# EasyEDA Pro project design-2.eprj, board PCB4_2
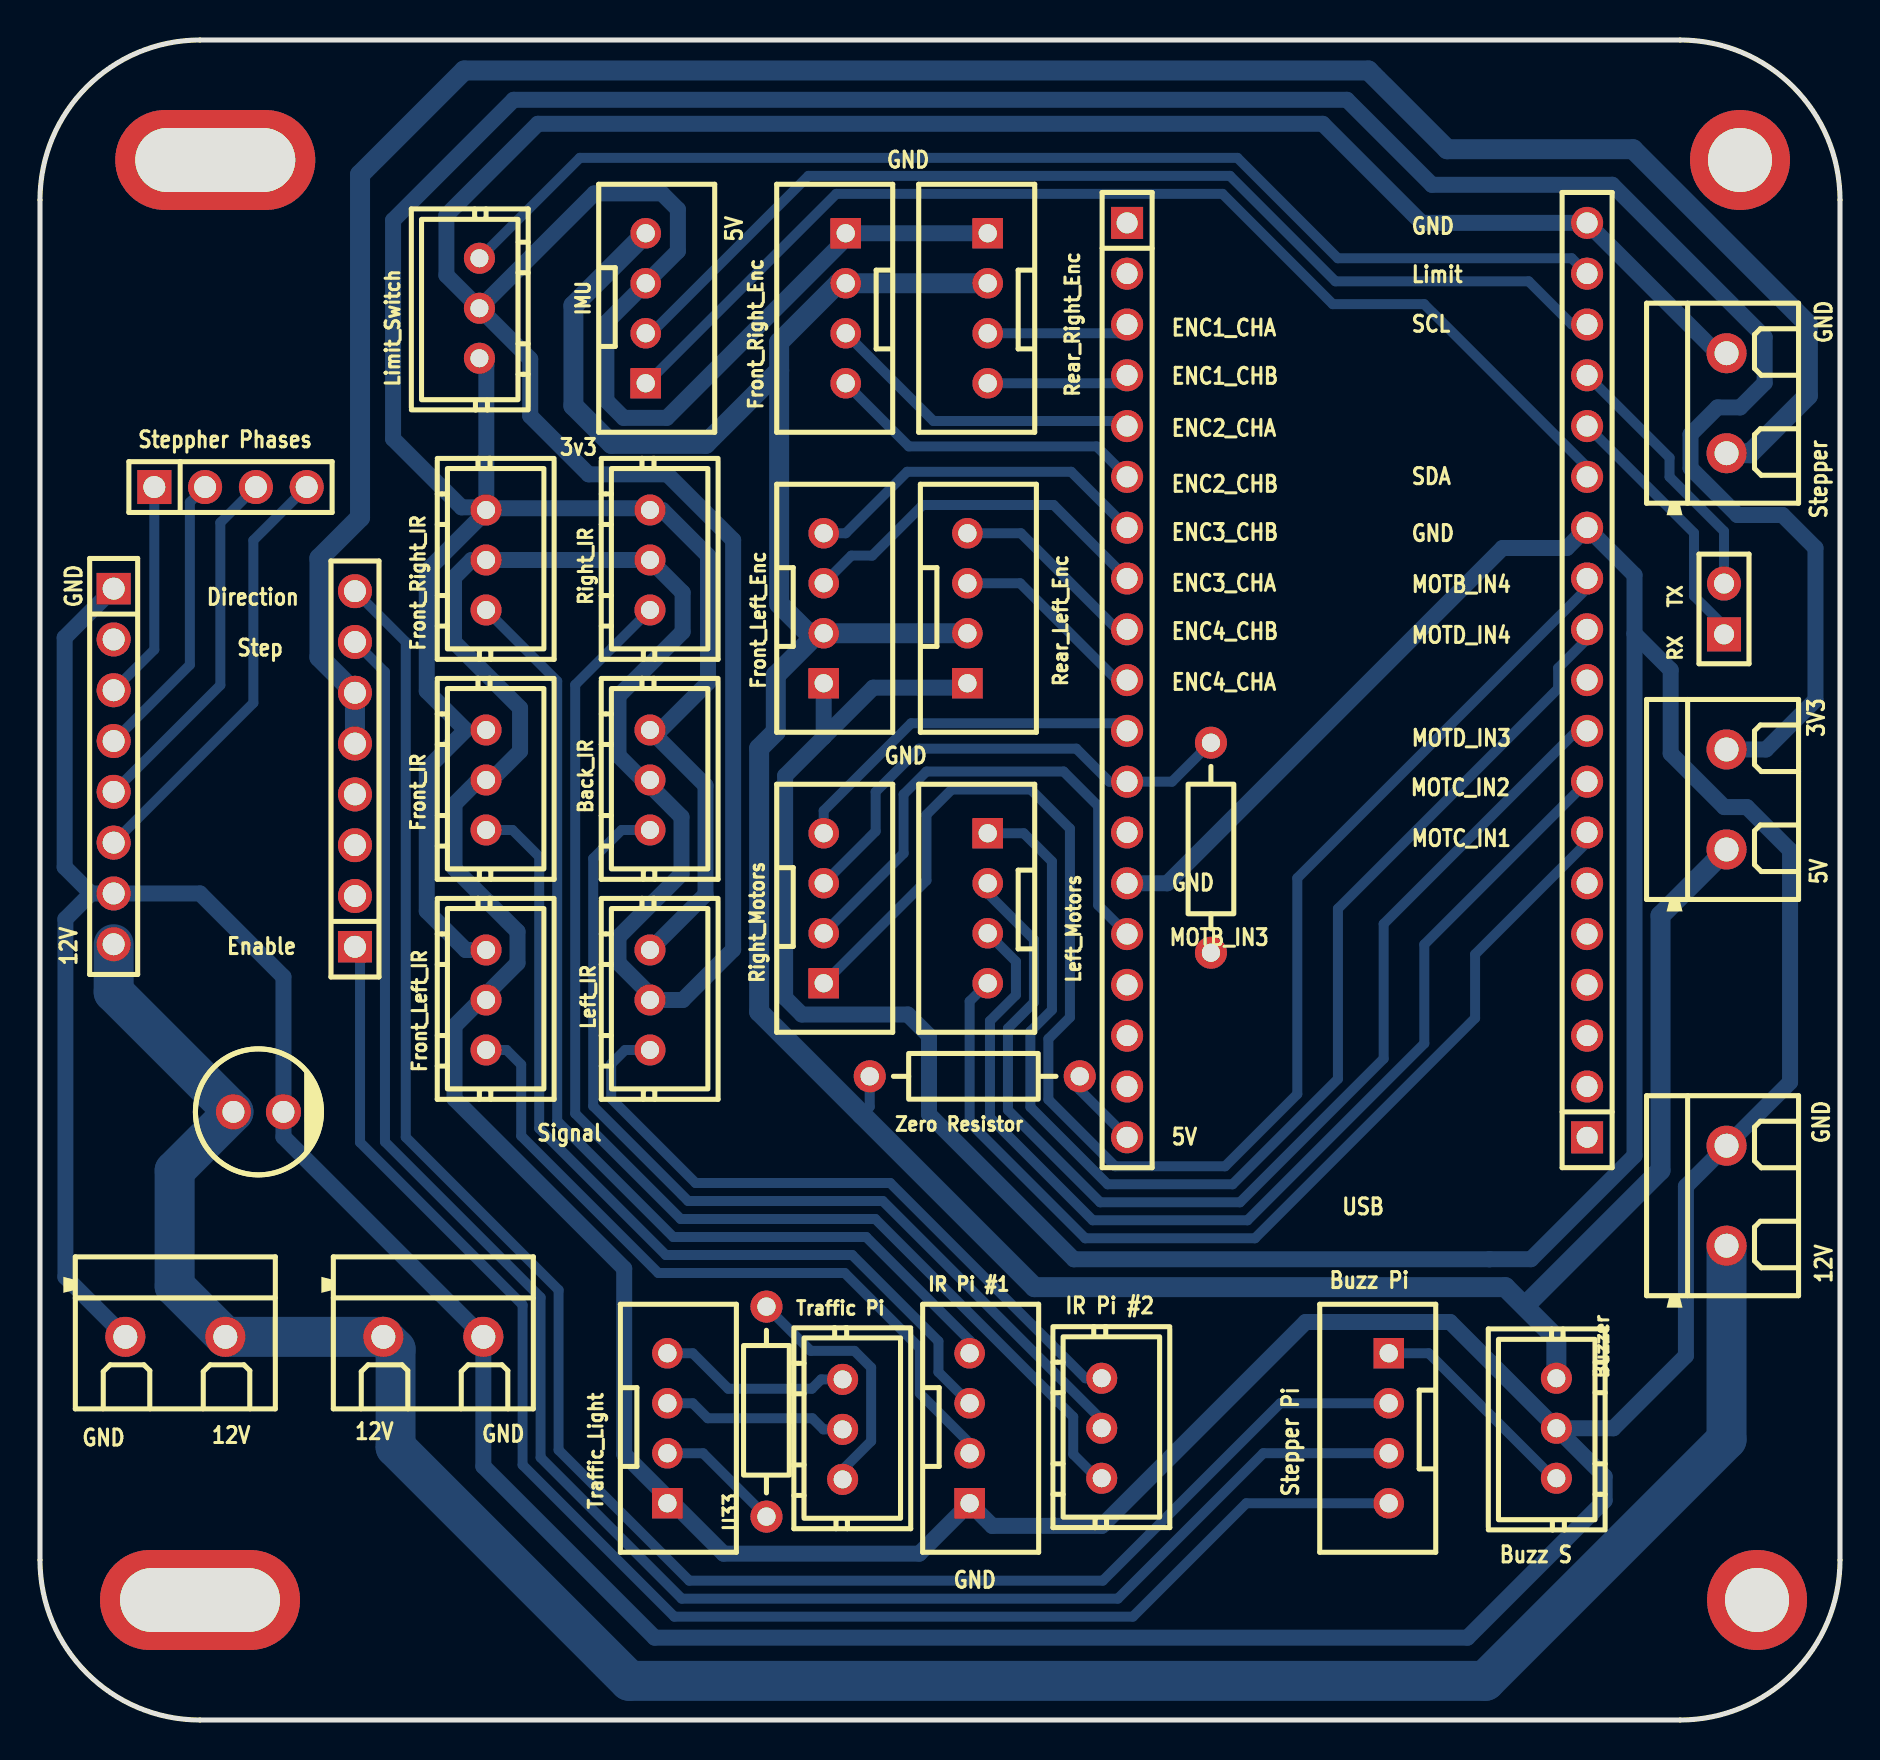
[diagram p4: board, top side]
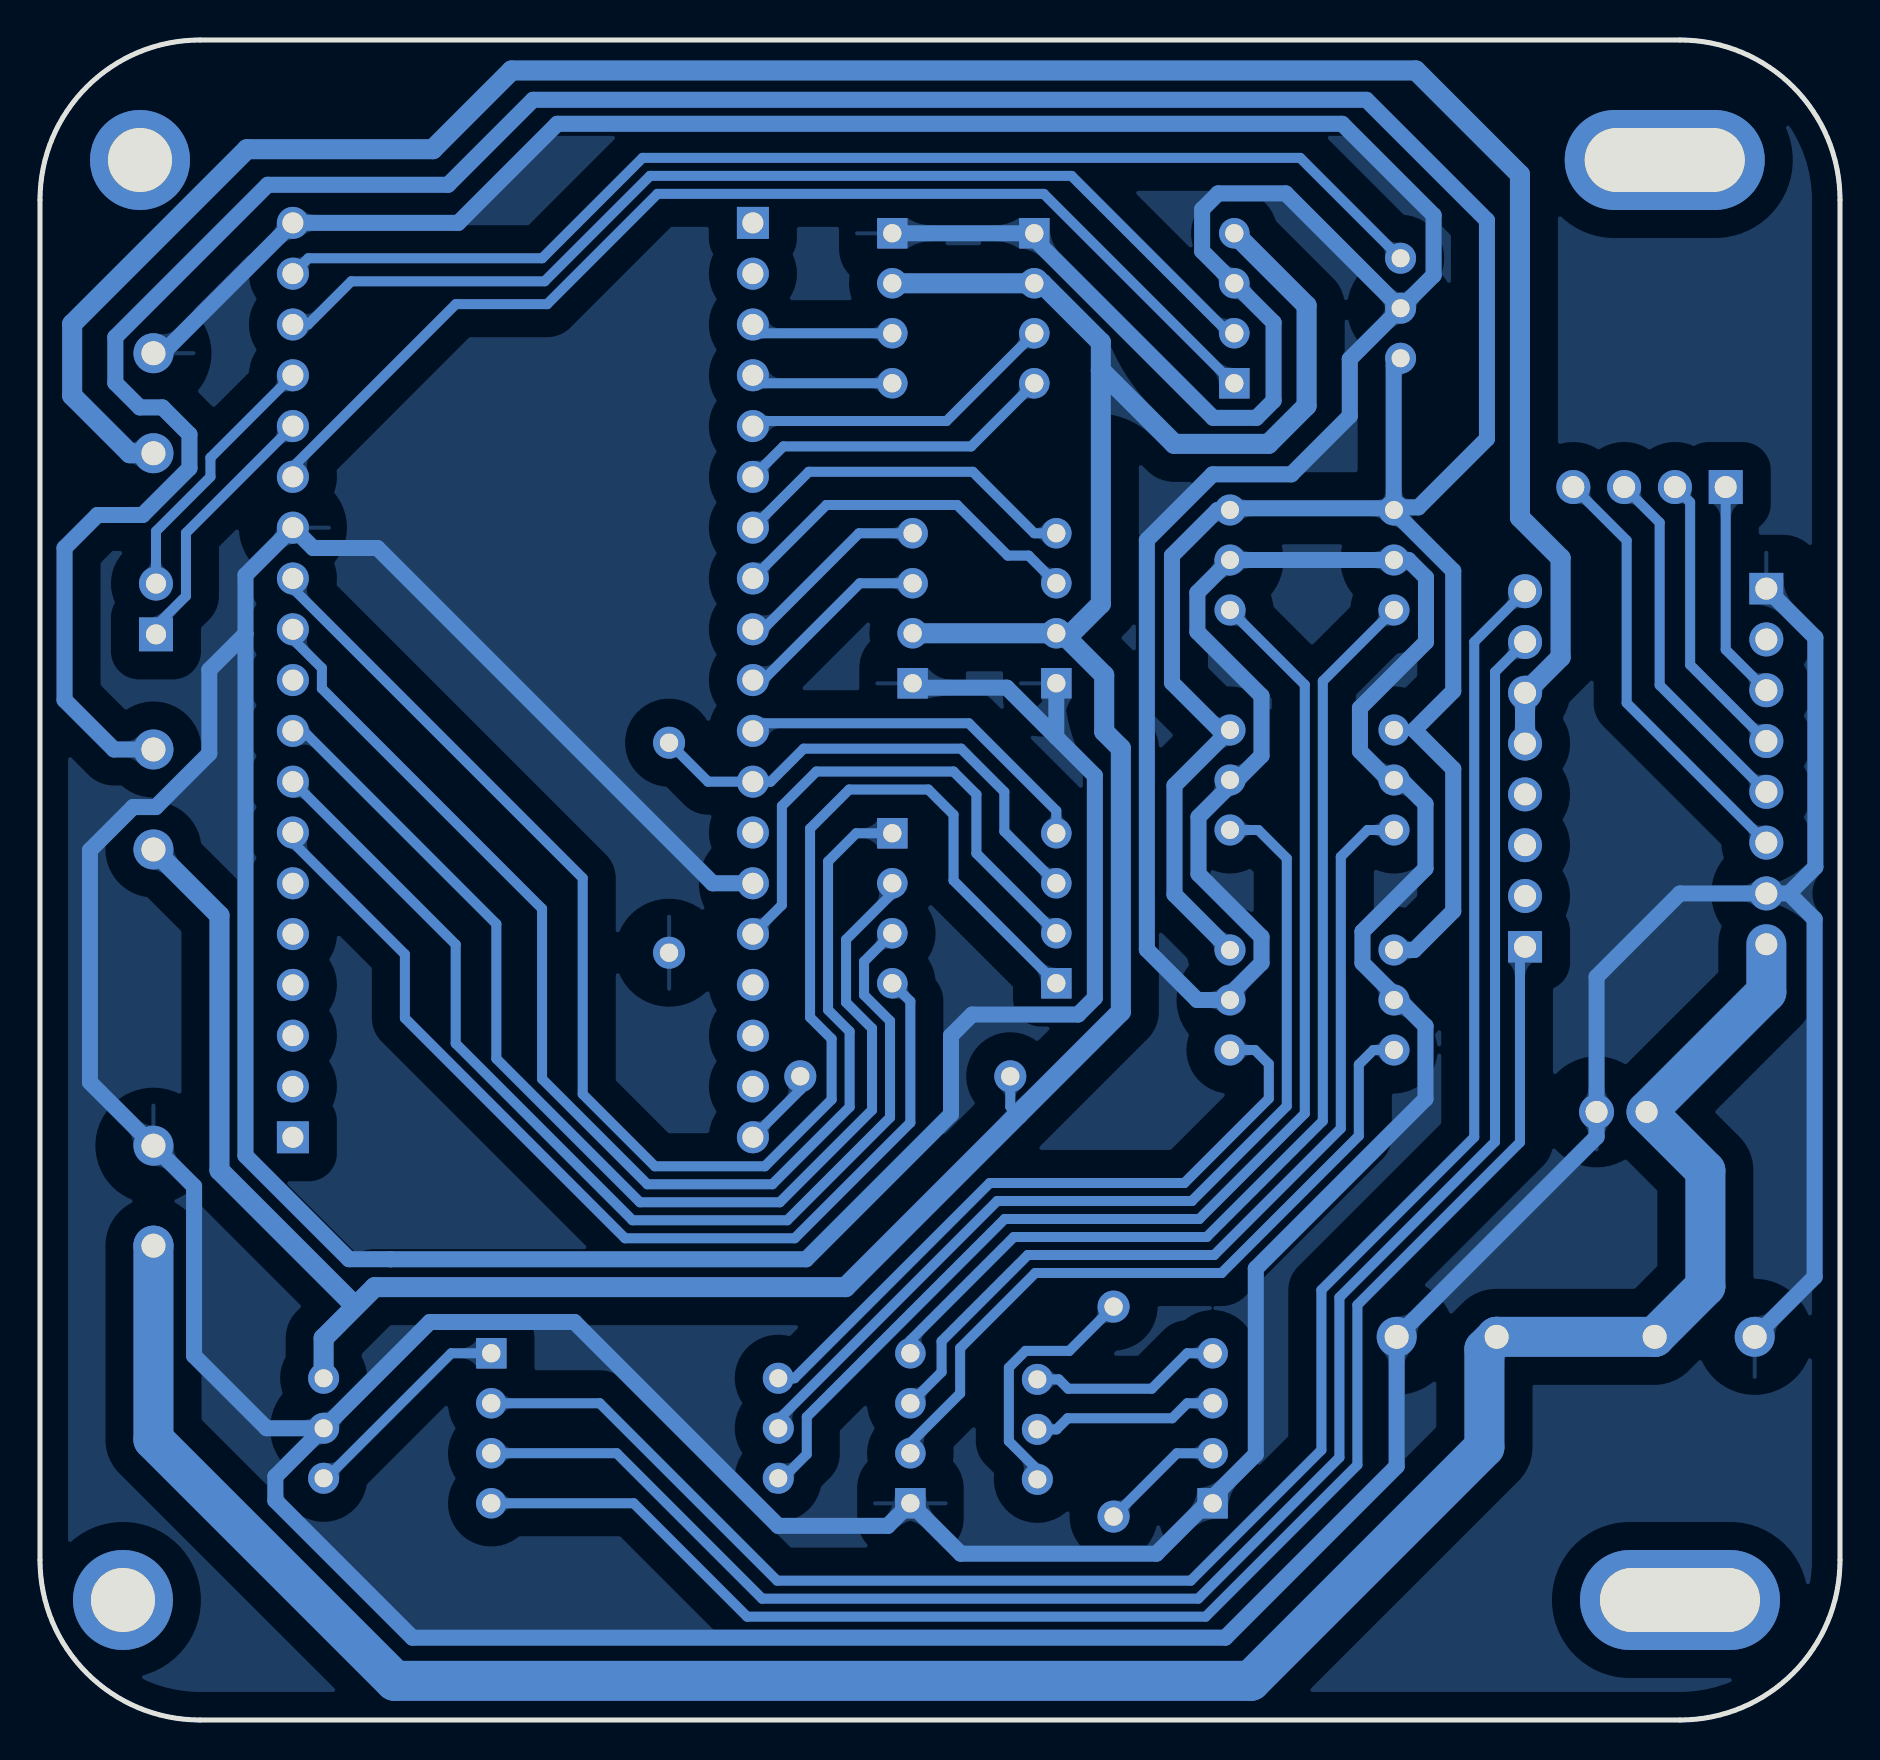
[diagram p5: board, bottom side, seen from below]

Outline 90 x 84 mm; copper layers: Top Layer, Bottom Layer. Coordinates in mm from the lower left corner of the outline.
Outline path: 0,76 0,8 arc(2.34,2.34) 8,0 82,0 arc(87.66,2.34) 90,8 90,76 arc(87.66,81.66) 82,84 8,84 arc(2.34,81.66) 0,76
Stack: Top Layer 0.035mm / Dielectric1 1.51mm FR4 er 4.5 / Bottom Layer 0.035mm

## Design rules (mm)
template: Custom Config
spacing copperThickness1oz (default): track to track 0.4, other pairs 0.4 to 0.6
spacing copperThickness2oz: track to track 0.203, other pairs 0.152 to 0.3
track width copperThickness1oz (default): min 0.4, default 0.5, max 2.54
track width copperThickness2oz: min 0.203, default 0.254, max 2.54
differential pair differentialPair (default): width min 0.127, default 0.254, max 2.54; gap min 0.152, default 0.152
via viaSize (default): diameter min 1.2, default 1.2, max 10; hole min 0.6, default 0.6, max 6.3

## Placement (name value [footprint] x y rotation side)
5V_SHARED+GND_IN  KF301-2P接线端子  [CONN-TH_XY301V-A-5.0-2P]  84.33 46.03 270 top
12V_MOTORS+GND  KF301-2P接线端子  [CONN-TH_XY301V-A-5.0-2P]  84.33 26.22 270 top
Back_IR  XY-B3B-XH-A  [CONN-TH_3P-P2.50_A2501WV2-3P]  30.5 47 90 top
Buzzer  XY-B3B-XH-A  [CONN-TH_3P-P2.50_A2501WV2-3P]  75.82 14.59 270 top
C3  100uF  [CAP-TH_BD6.3-P2.50-D0.6-FD-1]  10.92 30.41 0 top
DC_Driver_#1_Power  KF301-2P接线端子  [CONN-TH_XY301V-A-5.0-2P]  6.77 19.16 180 top
DC_Driver_#2_Power  KF301-2P接线端子  [CONN-TH_XY301V-A-5.0-2P]  19.67 19.16 180 top
ESP_L  2.54-1*19P母  [HDR-TH_19P-P2.54-V-F]  54.36 52 270 top
ESP_R  2.54-1*19P母  [HDR-TH_19P-P2.54-V-F]  77.36 52 90 top
Front_IR  XY-B3B-XH-A  [CONN-TH_3P-P2.50_A2501WV2-3P]  22.3 47 90 top
Front_Left_Enc  B4B-XH-A-G  [CONN-TH_B4B-XH-A-G]  39.19 55.59 90 top
Front_Left_IR  XY-B3B-XH-A  [CONN-TH_3P-P2.50_A2501WV2-3P]  22.3 36 90 top
Front_Right_Enc  B4B-XH-A-G  [CONN-TH_B4B-XH-A-G]  40.28 70.59 270 top
Front_Right_IR  XY-B3B-XH-A  [CONN-TH_3P-P2.50_A2501WV2-3P]  22.3 58 90 top
GND  -  [CONN-TH_B4B-XH-A-G]  67.44 14.59 270 top
IMU  B4B-XH-A-G  [CONN-TH_B4B-XH-A-G]  30.28 70.59 90 top
IR Pi #1   -  [CONN-TH_B4B-XH-A-G]  46.48 14.59 90 top
irpi  XY-B3B-XH-A  [CONN-TH_3P-P2.50_A2501WV2-3P]  53.09 14.59 90 top
Left_IR  XY-B3B-XH-A  [CONN-TH_3P-P2.50_A2501WV2-3P]  30.5 36 90 top
Left_Motors  B4B-XH-A-G  [CONN-TH_B4B-XH-A-G]  47.38 40.59 270 top
Limit_Switch  XY-B3B-XH-A  [CONN-TH_3P-P2.50_A2501WV2-3P]  21.97 70.59 270 top
NOREF  -  [Pad_e4803]  8 6 0 top
NOREF#2  -  [Pad_e4802]  85.85 6 0 top
NOREF#3  -  [Pad_e4799]  85 78 0 top
NOREF#4  -  [Pad_e4789]  8.76 78 0 top
Rear_Left_Enc  B4B-XH-A-G  [CONN-TH_B4B-XH-A-G]  46.37 55.59 90 top
Rear_Right_Enc  B4B-XH-A-G  [CONN-TH_B4B-XH-A-G]  47.38 70.59 270 top
Right_IR  XY-B3B-XH-A  [CONN-TH_3P-P2.50_A2501WV2-3P]  30.5 58 90 top
Right_Motors  B4B-XH-A-G  [CONN-TH_B4B-XH-A-G]  39.19 40.59 90 top
RX   TX  -  [HDR-TH_2P-P2.54-V-F]  84.2 55.55 90 top
Stepper_Driver_L  2.54-1*8P母环保  [HDR-TH_8P-P2.54-V-F]  15.75 47.55 90 top
Stepper_Driver_R  2.54-1*8P母环保  [HDR-TH_8P-P2.54-V-F]  3.68 47.68 270 top
Stepper_Phases  PH2.54-1X4P-H25  [HDR-TH_4P-P2.54-V-M]  9.53 61.65 0 top
Stepper_Pi_Power_IN  KF301-2P接线端子  [CONN-TH_XY301V-A-5.0-2P]  84.33 65.84 270 top
Traffic Pi  -  [CONN-TH_3P-P2.50_A2501WV2-3P]  40.13 14.53 90 top
Traffic_Light  B4B-XH-A-G  [CONN-TH_B4B-XH-A-G]  31.37 14.59 90 top
U33  180Ω  [RES-TH_BD2.2-L6.5-P10.50-D0.6]  36.32 15.42 90 top
U34  10KΩ  [RES-TH_BD2.2-L6.5-P10.50-D0.6]  58.55 43.61 270 top
Zero Resistor  -  [RES-TH_BD2.2-L6.5-P10.50-D0.6]  46.74 32.18 180 top

## Footprints (pads in the part's own frame, mm; a bottom-side part is the same pattern mirrored in y, then rotated)
CAP-TH_BD6.3-P2.50-D0.6-FD-1
  round 1.75 hole 1.1: 1(-1.25,0) 2(1.25,0)
CONN-TH_3P-P2.50_A2501WV2-3P
  round 1.55 hole 0.9: 1(-2.5,0) 2(0,0) 3(2.5,0)
CONN-TH_B4B-XH-A-G
  rect 1.524x1.524 hole 0.914: 1(-3.75,0)
  round 1.524 hole 0.914: 2(-1.25,0) 3(1.25,0) 4(3.75,0)
CONN-TH_XY301V-A-5.0-2P
  round 2 hole 1.2: 1(-2.5,0) 2(2.5,0)
HDR-TH_2P-P2.54-V-F
  rect 1.7x1.7 hole 1: 1(-1.27,0)
  round 1.7 hole 1: 2(1.27,0)
HDR-TH_4P-P2.54-V-M
  rect 1.7x1.7 hole 1.1: 1(-3.81,0)
  round 1.7 hole 1.1: 2(-1.27,0) 3(1.27,0) 4(3.81,0)
HDR-TH_8P-P2.54-V-F
  rect 1.575x1.7 hole 1.1: 1(-8.89,0)
  round 1.7 hole 1.1: 2(-6.35,0) 3(-3.81,0) 4(-1.27,0) 5(1.27,0) 6(3.81,0) 7(6.35,0) 8(8.89,0)
HDR-TH_19P-P2.54-V-F
  rect 1.6x1.6 hole 1.05: 1(-22.86,0)
  round 1.6 hole 1.05: 2(-20.32,0) 3(-17.78,0) 4(-15.24,0) 5(-12.7,0) 6(-10.16,0) 7(-7.62,0) 8(-5.08,0) 9(-2.54,0) 10(0,0) 11(2.54,0) 12(5.08,0) 13(7.62,0) 14(10.16,0) 15(12.7,0) 16(15.24,0) 17(17.78,0) 18(20.32,0) 19(22.86,0)
Pad_e4789
  oval 10x5 hole 8x3.2: 1(0,0)
Pad_e4799
  round 5 hole 3.2: 1(0,0)
Pad_e4802
  round 5 hole 3.2: 1(0,0)
Pad_e4803
  oval 10x5 hole 8x3.2: 1(0,0)
RES-TH_BD2.2-L6.5-P10.50-D0.6
  round 1.6 hole 0.914: 1(-5.25,0) 2(5.25,0)

## Nets
3V3_REF: 5V_SHARED+GND_IN.1 Back_IR.3 Front_IR.3 Front_Left_IR.3 Front_Right_IR.3 Left_IR.3 Limit_Switch.3 Right_IR.3
5V_SHARED: 5V_SHARED+GND_IN.2 Buzzer.1 Front_Left_Enc.2 Front_Right_Enc.2 IMU.4 Rear_Left_Enc.2 Rear_Right_Enc.2 Zero Resistor.2
5V_STEPPER: Stepper_Driver_L.5 Stepper_Driver_L.6 Stepper_Pi_Power_IN.2
12V_MOTORS: 12V_MOTORS+GND.2 C3.1 DC_Driver_#1_Power.1 DC_Driver_#2_Power.2 Stepper_Driver_R.8
GND: 12V_MOTORS+GND.1 Back_IR.2 Buzzer.2 C3.2 DC_Driver_#1_Power.2 DC_Driver_#2_Power.1 ESP_L.14 ESP_R.13 ESP_R.19 Front_IR.2 Front_Left_Enc.1 Front_Left_IR.2 Front_Right_Enc.1 Front_Right_IR.2 IMU.3 IR Pi #1 .1 Left_IR.2 Limit_Switch.2 Rear_Left_Enc.1 Rear_Right_Enc.1 Right_IR.2 Stepper_Driver_R.1 Stepper_Driver_R.7 Stepper_Pi_Power_IN.1 Traffic_Light.1 U34.2
ENC1_CHA: ESP_L.3 Rear_Right_Enc.3
ENC1_CHB: ESP_L.4 Rear_Right_Enc.4
ENC2_CHA: ESP_L.5 Front_Right_Enc.3
ENC2_CHB: ESP_L.6 Front_Right_Enc.4
ENC3_CHA: ESP_L.8 Front_Left_Enc.3
ENC3_CHB: ESP_L.7 Front_Left_Enc.4
ENC4_CHA: ESP_L.10 Rear_Left_Enc.3
ENC4_CHB: ESP_L.9 Rear_Left_Enc.4
ESP_5V: ESP_L.19 Zero Resistor.1
IMU_SCL: ESP_R.17 IMU.2
IMU_SDA: ESP_R.14 IMU.1
IR_SIG_1: irpi.1 Right_IR.1
IR_SIG_2: Back_IR.1 irpi.2
IR_SIG_3: Front_Right_IR.1 IR Pi #1 .4
IR_SIG_4: irpi.3 Left_IR.1
IR_SIG_5: Front_IR.1 IR Pi #1 .3
IR_SIG_6: Front_Left_IR.1 IR Pi #1 .2
LIMIT: ESP_R.18 Limit_Switch.1
MOTA_IN1: ESP_L.11 Right_Motors.4
MOTA_IN2: ESP_L.12 Right_Motors.3 U34.1
MOTB_IN3: ESP_L.15 Right_Motors.2
MOTB_IN4: ESP_R.12 Right_Motors.1
MOTC_IN1: ESP_R.7 Left_Motors.4
MOTC_IN2: ESP_R.8 Left_Motors.3
MOTD_IN3: ESP_R.9 Left_Motors.2
MOTD_IN4: ESP_R.11 Left_Motors.1
PI_BUZZER: Buzzer.3 GND.1
PI_DIR: GND.2 Stepper_Driver_L.8
PI_EN: GND.4 Stepper_Driver_L.1
PI_STEP: GND.3 Stepper_Driver_L.7
RX: ESP_R.15 RX   TX.1
STEP_A1: Stepper_Driver_R.3 Stepper_Phases.1
STEP_A2: Stepper_Driver_R.4 Stepper_Phases.2
STEP_B1: Stepper_Driver_R.5 Stepper_Phases.3
STEP_B2: Stepper_Driver_R.6 Stepper_Phases.4
TRAF_G: Traffic_Light.2 U33.1
TRAF_G_SAFE: Traffic Pi.1 U33.2
TRAF_R: Traffic Pi.3 Traffic_Light.4
TRAF_Y: Traffic Pi.2 Traffic_Light.3
TX: ESP_R.16 RX   TX.2

Pads without a net: ESP_L 1 2 13 16 17 18; ESP_R 1 2 3 4 5 6 10; NOREF 1; NOREF#2 1; NOREF#3 1; NOREF#4 1; Stepper_Driver_L 2 3 4; Stepper_Driver_R 2

## Routing (per net, layer and track width the routed paths; a pad name or vN(x,y) marks a point on that pad's centre or on a via; arc(x,y) is an arc through that point)
3V3_REF: length 192.9
  Bottom Layer w0.8: Limit_Switch.3 22.32,67.74 22.32,60.84 22.14,60.67 ; 22.14,60.67 21.97,60.5 ; 22.14,60.67 Front_Right_IR.3 22.39,60.59 30.41,60.59 Right_IR.3 31.12,60.5 33.4,58.22 33.4,51.87 31.03,49.5 Back_IR.3 33.28,46.72 33.28,41.28 Left_IR.3 ; 21.97,60.5 21.97,60.63 21.08,60.63 17.65,64.06 17.65,74.98 23.68,81.01 65.35,81.01 69.6,76.76 78.61,76.76 86.23,69.14 86.23,66.86 85.01,65.63 83.88,65.63 82.53,64.28 82.53,62.59 84.87,60.25 87.12,60.25 88.77,58.6 88.77,51 86.3,48.53 5V_SHARED+GND_IN.1 ; 21.97,60.5 22.18,60.3 19.34,57.46 19.34,51.45 21.28,49.5 19.34,47.55 19.34,40.45 21.28,38.5 Front_Left_IR.3
5V_SHARED: length 155.1
  Bottom Layer w0.5: Zero Resistor.2 41.49,30.66 41.09,30.27
  Bottom Layer w1: 75.82,17.09 75.82,19.09 73.26,21.64 49.72,21.64 35.96,35.41 35.96,48.58 36.79,49.42 36.79,52.24 38.89,54.34 ; 38.89,54.34 38.43,54.34 36.96,55.81 36.96,67.48 ; 38.89,54.34 Front_Left_Enc.2 Rear_Left_Enc.2 ; 74.42,20.88 81.03,27.48 81.03,40.22 5V_SHARED+GND_IN.2 ; IMU.4 26.67,70.72 26.67,65.71 28.57,63.81 33.29,63.81 36.96,67.48 ; Rear_Right_Enc.2 Front_Right_Enc.2 39.91,71.84 36.96,68.89 36.96,67.48
5V_STEPPER: length 118.7
  Bottom Layer w1: Stepper_Driver_L.5 Stepper_Driver_L.6 13.97,53.14 13.97,58.09 16,60.12 16,77.27 21.21,82.48 66.42,82.48 70.36,78.54 79.65,78.54 88.39,69.8 88.39,66.22 85.51,63.34 Stepper_Pi_Power_IN.2
12V_MOTORS: length 124.1
  Bottom Layer w2: Stepper_Driver_R.8 3.68,36.39 C3.1 6.73,27.47 6.73,21.69 DC_Driver_#1_Power.1 DC_Driver_#2_Power.2 17.78,18.55 17.78,13.64 29.46,1.96 72.26,1.96 84.33,14.02 12V_MOTORS+GND.2
GND: length 652.8
  Bottom Layer w0.8: 21.93,47 21.92,47 ; 21.93,47 22.56,47 24,48.44 24,50.6 20.7,53.9 20.7,57.12 21.57,58 21.92,58 21.92,58 ; 21.93,47 20.73,45.8 20.73,42.57 23.88,39.42 23.88,37.85 20.73,34.7 20.73,31.06 29.21,22.57 29.21,13.29 34.18,8.32 43.96,8.32 IR Pi #1 .1 47.61,9.71 53.09,9.71 63.28,19.9 70.51,19.9 Buzzer.2 ; Buzzer.2 78.67,14.59 82.3,18.21 82.3,26.68 12V_MOTORS+GND.1 87.5,31.89 87.5,43.49 85.34,45.65 84.21,45.65 81.53,48.32 81.53,52.5 79.73,54.31 ; Buzzer.2 78.23,12.17 78.23,10.97 71.37,4.12 30.73,4.12 22.17,12.68 DC_Driver_#2_Power.1 12.17,29.15 C3.2 12.17,37.16 8,41.33 Stepper_Driver_R.7 2.55,41.33 ; Front_Left_Enc.1 39.19,49.14 ; 39.19,49.14 37.26,47.22 37.26,36.11 38.09,35.28 43.39,35.28 44.45,34.22 44.45,30.28 51.69,23.04 72.47,23.04 72.48,23.04 74.55,23.04 79.73,28.22 79.73,54.31 ; 39.19,49.14 41.66,51.61 46.15,51.61 Rear_Left_Enc.1 ; 79.73,54.31 79.73,57.25 ESP_R.13 76.34,58.6 73.13,58.6 56.36,41.84 ESP_L.14 ; Stepper_Driver_R.1 1.23,54.12 1.23,42.65 2.55,41.33 ; 2.55,41.33 1.27,40.05 1.27,22.15 DC_Driver_#1_Power.2 ; Limit_Switch.2 20.32,72.24 20.32,75.24 24.89,79.81 64.13,79.81 69.09,74.86 ESP_R.19 83.87,68.34 Stepper_Pi_Power_IN.1 ; Limit_Switch.2 24.51,68.05 24.51,65.2 27.43,62.28 31.37,62.28 34.66,59 34.66,38.52 32.14,36 Left_IR.2 30.5,36.27 28.93,37.85 28.93,39.15 32.07,42.3 32.07,45.15 30.5,46.73 Back_IR.2 30.14,47 28.93,48.22 28.93,51.2 32.13,54.41 32.13,56.37 Right_IR.2 Front_Right_IR.2 ; Limit_Switch.2 27.71,76.33 31.09,76.33 31.89,75.53 31.89,73.45 IMU.3 ; IMU.3 28.32,69.87 28.32,65.97 29.18,65.11 31.34,65.11 40.28,74.05 Front_Right_Enc.1 Rear_Right_Enc.1 ; IMU.3 30.44,71.84
ENC1_CHA: length 7.2
  Bottom Layer w0.5: Rear_Right_Enc.3 53.92,69.34 ESP_L.3
ENC1_CHB: length 7.1
  Bottom Layer w0.5: ESP_L.4 53.96,66.84 Rear_Right_Enc.4
ENC2_CHA: length 16
  Bottom Layer w0.5: Front_Right_Enc.3 44.67,64.95 54.1,64.95 ESP_L.5
ENC2_CHB: length 16
  Bottom Layer w0.5: ESP_L.6 52.83,63.68 43.44,63.68 Front_Right_Enc.4
ENC3_CHA: length 18.3
  Bottom Layer w0.5: Front_Left_Enc.3 40.57,58.22 41.61,58.22 44.14,60.75 50.68,60.75 ESP_L.8
ENC3_CHB: length 17.6
  Bottom Layer w0.5: Front_Left_Enc.4 40.28,59.34 43.36,62.41 51.56,62.41 ESP_L.7
ENC4_CHA: length 10
  Bottom Layer w0.5: Rear_Left_Enc.3 49.01,56.84 53.85,52 ESP_L.10
ENC4_CHB: length 10
  Bottom Layer w0.5: Rear_Left_Enc.4 49.05,59.34 53.85,54.54 ESP_L.9
ESP_5V: length 4
  Bottom Layer w0.5: Zero Resistor.1 51.99,31.51 ESP_L.19
IMU_SCL: length 53.4
  Bottom Layer w0.5: IMU.2 30.41,69.46 30.68,69.46 38.42,77.21 59.5,77.21 64.77,71.94 74.44,71.94 76.59,69.78 ESP_R.17
IMU_SDA: length 57.1
  Bottom Layer w0.5: ESP_R.14 77.36,62.65 69.21,70.79 64.64,70.79 59.13,76.31 39.81,76.31 30.34,66.84 IMU.1
IR_SIG_1: length 62.1
  Bottom Layer w0.5: 53.34,11.61 51.66,13.29 51.66,15.16 41.77,25.05 32.03,25.05 26.76,30.32 26.76,51.76 Right_IR.1
IR_SIG_2: length 48.3
  Bottom Layer w0.5: 53.5,14.59 42.14,25.95 32.41,25.95 27.66,30.7 27.66,43.08 29.08,44.5 Back_IR.1
IR_SIG_3: length 52.8
  Bottom Layer w0.5: IR Pi #1 .4 46.48,18.98 41.31,24.15 31.66,24.15 25.86,29.95 25.86,51.94 Front_Right_IR.1
IR_SIG_4: length 34.3
  Bottom Layer w0.5: 53.09,17.09 52.27,17.09 42.51,26.85 32.78,26.85 28.56,31.07 28.56,32.8 29.26,33.5 Left_IR.1
IR_SIG_5: length 44.9
  Bottom Layer w0.5: IR Pi #1 .3 44.92,17.4 44.92,18.94 40.61,23.25 31.29,23.25 24.96,29.58 24.96,43.17 23.62,44.5 Front_IR.1
IR_SIG_6: length 36.2
  Bottom Layer w0.5: Front_Left_IR.1 23.33,33.5 24.06,32.77 24.06,29.21 30.92,22.35 40.24,22.35 43.99,18.59 43.99,16.33 46.48,13.84 IR Pi #1 .2
LIMIT: length 59.9
  Bottom Layer w0.5: ESP_R.18 76.59,73.09 64.89,73.09 59.87,78.11 26.99,78.11 Limit_Switch.1
MOTA_IN1: length 18.3
  Bottom Layer w0.5: ESP_L.11 53.97,49.84 43.56,49.84 39.19,45.46 Right_Motors.4
MOTA_IN2: length 24.8
  Bottom Layer w0.5: U34.1 56.6,46.92 ESP_L.12 53.47,46.92 51.82,48.57 43.94,48.57 41.78,46.41 41.78,44.44 Right_Motors.3
MOTB_IN3: length 26.5
  Bottom Layer w0.5: ESP_L.15 52.91,40.75 52.91,45.7 51.18,47.42 44.32,47.42 43.18,46.28 43.18,43.33 Right_Motors.2
MOTB_IN4: length 80.2
  Bottom Layer w0.5: Right_Motors.1 44.32,41.97 44.32,45.27 45.58,46.52 49.54,46.52 51.5,44.57 51.5,35.13 50.42,34.06 50.42,31.02 53.76,27.69 59.26,27.69 62.87,31.3 62.87,42.1 77.36,56.59 ESP_R.12
MOTC_IN1: length 51.2
  Bottom Layer w0.5: ESP_R.7 77.36,43.89 71.75,38.29 71.75,35.09 60.75,24.09 52.26,24.09 46.48,29.87 46.48,35.93 Left_Motors.4
MOTC_IN2: length 54.3
  Bottom Layer w0.5: Left_Motors.3 48.8,37.92 48.8,36.25 47.5,34.95 47.5,30.12 52.64,24.99 60.37,24.99 69.22,33.83 69.22,38.78 ESP_R.8
MOTD_IN3: length 57.4
  Bottom Layer w0.5: ESP_R.9 76.84,49.46 67.18,39.8 67.18,33.07 60,25.89 53.01,25.89 48.4,30.5 48.4,34.58 49.7,35.88 49.7,39.02 47.38,41.33 Left_Motors.2
MOTD_IN4: length 63.3
  Bottom Layer w0.5: ESP_R.11 77.36,54.05 75.91,52.6 75.91,51.58 64.9,40.57 64.9,32.05 59.63,26.79 53.38,26.79 49.52,30.65 49.52,34.43 50.6,35.51 50.6,42.93 49.19,44.34 Left_Motors.1
PI_BUZZER: length 11
  Bottom Layer w0.5: GND.1 69.44,18.34 75.69,12.09 Buzzer.3
PI_DIR: length 95
  Bottom Layer w0.5: GND.2 62.01,15.84 53.14,6.97 32.46,6.97 25.93,13.5 25.93,21.5 18.29,29.14 18.29,53.9 Stepper_Driver_L.8
PI_EN: length 78.2
  Bottom Layer w0.5: Stepper_Driver_L.1 16,38.41 16,28.88 24.13,20.75 24.13,12.75 31.72,5.17 54.64,5.17 60.31,10.84 GND.4
PI_STEP: length 93.7
  Bottom Layer w0.5: GND.3 67.44,13.84 66.94,13.34 61.17,13.34 53.89,6.07 32.09,6.07 25.03,13.13 25.03,21.13 17.25,28.91 17.25,52.4 Stepper_Driver_L.7
RX: length 13.2
  Bottom Layer w0.5: ESP_R.15 82.7,59.35 82.7,56.2 84.2,54.7 RX   TX.1
STEP_A1: length 11
  Bottom Layer w0.5: Stepper_Phases.1 5.72,53.52 Stepper_Driver_R.3
STEP_A2: length 14.6
  Bottom Layer w0.5: Stepper_Driver_R.4 7.49,52.76 7.49,60.89 Stepper_Phases.2
STEP_B1: length 18.2
  Bottom Layer w0.5: Stepper_Driver_R.5 9.02,51.74 9.02,59.87 Stepper_Phases.3
STEP_B2: length 21.8
  Bottom Layer w0.5: Stepper_Phases.4 10.67,58.98 10.67,50.85 Stepper_Driver_R.6
TRAF_G: length 6.3
  Bottom Layer w0.5: Traffic_Light.2 33.16,13.34 U33.1
TRAF_G_SAFE: length 12.7
  Bottom Layer w0.5: Traffic Pi.1 40.13,12.52 41.56,13.94 41.56,17.62 40.72,18.46 38.54,18.46 U33.2
TRAF_R: length 9.7
  Bottom Layer w0.5: Traffic Pi.3 39.06,17.03 38.59,16.56 34.41,16.56 32.64,18.34 Traffic_Light.4
TRAF_Y: length 9.3
  Bottom Layer w0.5: Traffic_Light.3 32.64,15.84 33.39,15.09 38.62,15.09 39.17,14.53 Traffic Pi.2
TX: length 13.2
  Bottom Layer w0.5: RX   TX.2 84.2,59.44 81.48,62.16 81.48,63.11 ESP_R.16

## Copper pours and planes (outline as drawn; the poured copper is in the pictures)
GND on Bottom Layer: -1.02,83.75 92.46,83.75 92.46,-2.36 -1.02,-2.36

Small or netless copper shapes (teardrops, artwork), in the pictures only: 156 on Bottom Layer

## Text on the board
Top Silkscreen Layer: Direction | Enable | Step | GND | IR Pi #2 | Buzz Pi | Buzz S | 12V | 5V | Stepper Pi | 3V3 | Stepper | Steppher Phases | Signal | 3v3 | MOTB_IN3 | ENC1_CHA | ENC1_CHB | ENC2_CHA | ENC2_CHB | ENC3_CHB | ENC3_CHA | ENC4_CHB | ENC4_CHA | USB | MOTC_IN2 | Limit | SCL | SDA | MOTB_IN4 | MOTD_IN4 | MOTD_IN3 | MOTC_IN1
